# Altium schematic sheet [05] SENSORS.SchDoc
size A
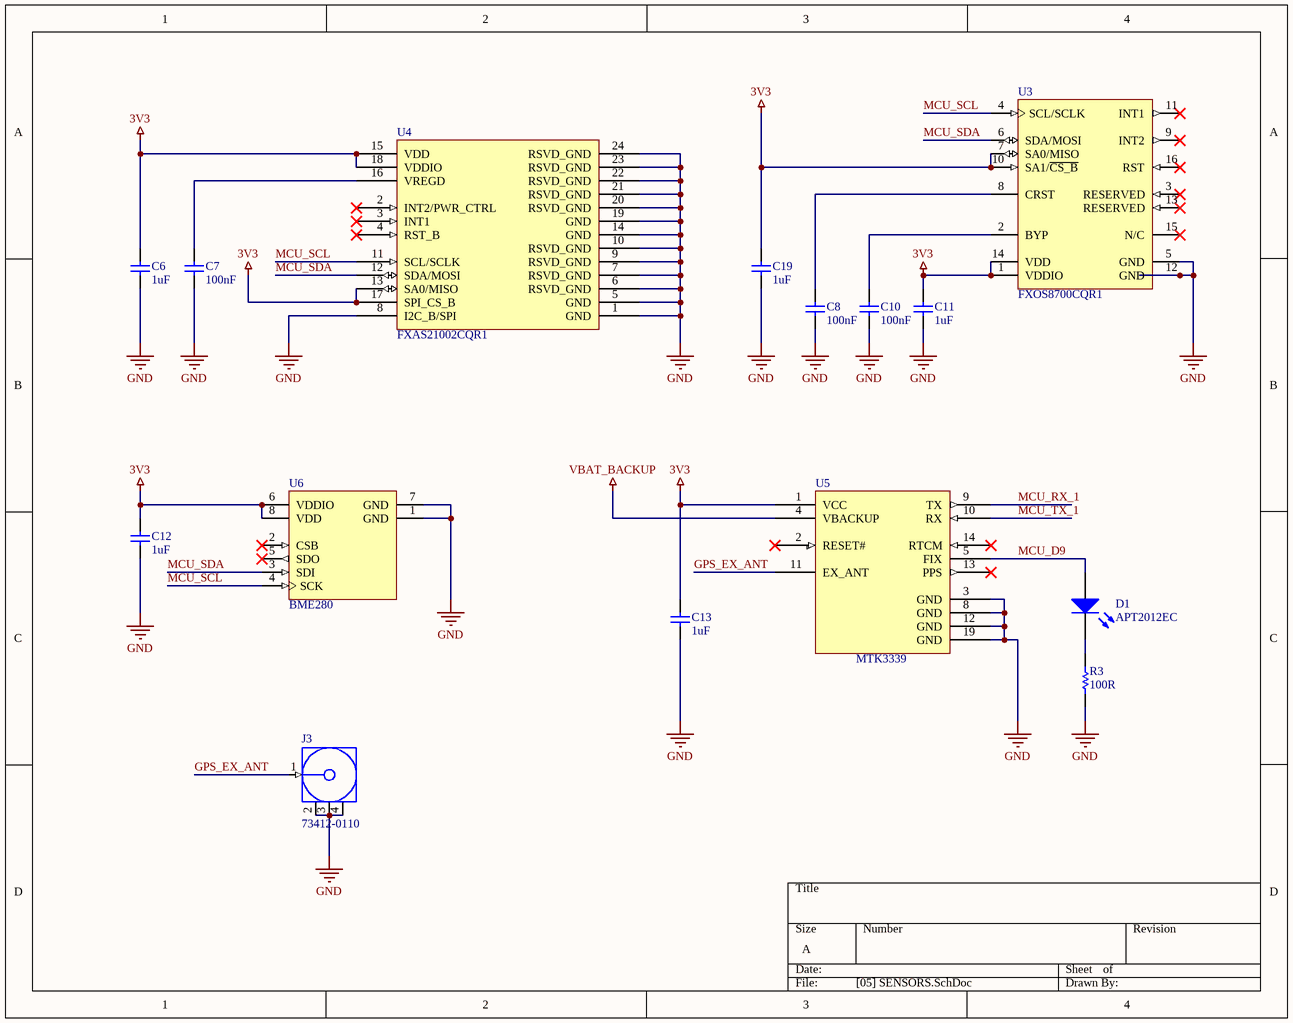
[diagram p0: [05] SENSORS.SchDoc]

## Parts
C6  1uF  [INCH 0805 - METRIC 2012 - H140]
C7  100nF  [INCH 0805 - METRIC 2012 - H120]
C8  100nF  [INCH 0805 - METRIC 2012 - H120]
C10  100nF  [INCH 0805 - METRIC 2012 - H120]
C11  1uF  [INCH 0805 - METRIC 2012 - H140]
C12  1uF  [INCH 0805 - METRIC 2012 - H140]
C13  1uF  [INCH 0805 - METRIC 2012 - H140]
C19  1uF  [INCH 0805 - METRIC 2012 - H140]
D1  APT2012EC  [LED - 0805 - GREEN]
J3  73412-0110  [MOLX-73412-0110_V]
R3  100R  [INCH 0805 - METRIC 2012 - H070]
U3  FXOS8700CQR1  [FREE-QFN-16-3000X3000DE_V]
U4  FXAS21002CQR1  [FXAS21002CQR1]
U5  MTK3339  [MTK3339]
U6  BME280  [BOSC-BME280-8_V]

## Nets
3V3: C6.2 C11.2 C12.2 C13.2 C19.2 U3.1(VDDIO) U3.7(SA0/MISO) U3.10(SA1/~{CS_B}) U3.14(VDD) U4.13(SA0/MISO) U4.15(VDD) U4.17(SPI_CS_B) U4.18(VDDIO) U5.1(VCC) U6.6(VDDIO) U6.8(VDD)
GND: C6.1 C7.1 C8.1 C10.1 C11.1 C12.1 C13.1 C19.1 J3.2(GND) J3.3(GND) J3.4(GND) R3.1 U3.5(GND) U3.12(GND) U4.1(GND) U4.5(GND) U4.6(RSVD_GND) U4.7(RSVD_GND) U4.8(I2C_B/SPI) U4.9(RSVD_GND) U4.10(RSVD_GND) U4.14(GND) U4.19(GND) U4.20(RSVD_GND) U4.21(RSVD_GND) U4.22(RSVD_GND) U4.23(RSVD_GND) U4.24(RSVD_GND) U5.3(GND) U5.8(GND) U5.12(GND) U5.19(GND) U6.1(GND) U6.7(GND)
VBAT_BACKUP: U5.4(VBACKUP)
GPS_EX_ANT: J3.1(SIGNAL) U5.11(EX_ANT)
MCU_D9: D1.A U5.5(FIX)
MCU_RX_1: U5.9(TX)
MCU_SCL: U3.4(SCL/SCLK) U4.11(SCL/SCLK) U6.4(SCK)
MCU_SDA: U3.6(SDA/MOSI) U4.12(SDA/MOSI) U6.3(SDI)
MCU_TX_1: U5.10(RX)
NetC7_2: C7.2 U4.16(VREGD)
NetC8_2: C8.2 U3.8(CRST)
NetC10_2: C10.2 U3.2(BYP)
NetD1_C: D1.C R3.2

Not connected (* = marked no-connect by the designer): U3 3(RESERVED)* 9(INT2)* 11(INT1)* 13(RESERVED)* 15(N/C)* 16(RST)*; U4 2(INT2/PWR_CTRL)* 3(INT1)* 4(RST_B)*; U5 2(RESET#)* 13(PPS)* 14(RTCM)*; U6 2(CSB)* 5(SDO)*

## Library data of the parts
C6 C11-C13 C19 = GCM21BR71E105KA56L: CAP SMD 1uF 25V 10% 0805; Manufacturer: Murata; Dielectric: X7R; Supplier 1: Digi-Key; Manufacturer Part Number: GCM21BR71E105KA56L; RoHS: Yes; Category: Ceramic Capacitors; Stock 1: 1572955; Pricing 1: 1=0.33000, 10=0.22500, 100=0.12760, 500=0.09004, 1000=0.07878 (USD); Mount: Surface Mount; Case/Package: 0805; Case Code (Metric): 2012; Case Code (Imperial): 0805; Min Operating Temperature: -55°C; Max Operating Temperature: 125°C; Termination: SMD/SMT; Voltage: 25V; Package Quantity: 3000; Capacitance: 1uF; Voltage Rating: 25V; Tolerance: 10%; Packaging: Tape and Reel; Voltage Rating (DC): 25V; Length: 2mm; Height: 1.25mm; Thickness: 0.055inch; Depth: 1.25mm; Width: 0.049inch; Ratings: AEC-Q200; Radiation Hardening: No; REACH SVHC: No SVHC; Lead Free: Lead Free; ComponentLink1URL: https://datasheet.ciiva.com/3778/359gcm21br71e105ka5623-3778560.pdf?src-supplier=Arrow; ComponentLink1Description: https://datasheet.ciiva.com/3778/359gcm21br71e105ka5623-3778560.pdf?src-supplier=Arrow; ComponentLink2URL: https://datasheet.ciiva.com/16624/product-16624576.pdf?src-supplier=Avnet+Europe; ComponentLink2Description: https://datasheet.ciiva.com/16624/product-16624576.pdf?src-supplier=Avnet+Europe; ComponentLink3URL: https://datasheet.ciiva.com/18183/getdatasheetpartid-153106-18183696.pdf?src-supplier=Verical; ComponentLink3Description: https://datasheet.ciiva.com/18183/getdatasheetpartid-153106-18183696.pdf?src-supplier=Verical; ComponentLink4URL: https://datasheet.ciiva.com/11789/0900766b80ef92d0-11789092.pdf?src-supplier=RSComponents; ComponentLink4Description: https://datasheet.ciiva.com/11789/0900766b80ef92d0-11789092.pdf?src-supplier=RSComponents; ComponentLink5URL: https://datasheet.ciiva.com/137/product-137199.pdf?src-supplier=Digi-Key; ComponentLink5Description: https://datasheet.ciiva.com/137/product-137199.pdf?src-supplier=Digi-Key; ComponentLink6URL: https://datasheet.ciiva.com/137/product-137200.pdf?src-supplier=Digi-Key; ComponentLink6Description: https://datasheet.ciiva.com/137/product-137200.pdf?src-supplier=Digi-Key; ComponentLink7URL: https://datasheet.ciiva.com/137/product-137201.pdf?src-supplier=Digi-Key; ComponentLink7Description: https://datasheet.ciiva.com/137/product-137201.pdf?src-supplier=Digi-Key; ComponentLink8URL: https://datasheet.ciiva.com/2989/product-2989245.pdf?src-supplier=Avnet; ComponentLink8Description: https://datasheet.ciiva.com/2989/product-2989245.pdf?src-supplier=Avnet; ComponentLink9URL: https://datasheet.ciiva.com/2989/product-2989246.pdf?src-supplier=Avnet; ComponentLink9Description: https://datasheet.ciiva.com/2989/product-2989246.pdf?src-supplier=Avnet; Supplier Part Number 1: 490-4785-1-ND
C7 C8 C10 = C0805C104K1RACTU: CAP CER 0.1UF 100V X7R 0805; Manufacturer: KEMET; Dielectric Material: Ceramic; Tolerance: 10%; Dissipation Factor: 2.5%; Supplier 1: Digi-Key; Manufacturer Part Number: C0805C104K1RACTU; Stock 1: 25000; Pricing 1: 1=0.33, 10=0.226, 100=0.1147, 500=0.07848, 1000=0.06943 (USD); Mount: Surface Mount,PCB; Case/Package: 0805; Number of Pins: 2; Case Code (Imperial): 0805; Case Code (Metric): 2012; Contact Plating: Tin,Matte; Min Operating Temperature: -55°C; Max Operating Temperature: 125°C; Capacitance: 100nF; Voltage Rating: 100V; Packaging: Tape and Reel; Package Quantity: 1; Voltage Rating (DC): 100V; Dielectric: X7R; Termination: SMD/SMT; Voltage: 100V; Length: 2mm; Height: 1mm; Width: 1.2mm; Lead Pitch: 0.75mm; Thickness: 0.043inch; Depth: 1.25mm; Radiation Hardening: No; REACH SVHC: No SVHC; ComponentLink1URL: https://datasheet.ciiva.com/7842/1776102-7842535.pdf; ComponentLink1Description: https://datasheet.ciiva.com/7842/1776102-7842535.pdf; ComponentLink2URL: https://datasheet.ciiva.com/14589/70095383-14589479.pdf; ComponentLink2Description: https://datasheet.ciiva.com/14589/70095383-14589479.pdf; ComponentLink3URL: https://datasheet.ciiva.com/5411/kem-c1002-x7r-smd-5411498.pdf; ComponentLink3Description: https://datasheet.ciiva.com/5411/kem-c1002-x7r-smd-5411498.pdf; Supplier Part Number 1: 399-3486-1-ND; Category: Capacitor
D1 = APT2012EC: LED RED CLEAR CHIP SMD; Manufacturer: Kingbright; Power Rating: 75mW; Luminous Intensity: 12mcd; Viewing Angle: 120°; Lens Style: Clear,Flat; Number of LEDs: 1; Wavelength: 625nm; Test Current: 20mA; Forward Voltage: 2V; Supplier 1: Digi-Key; Manufacturer Part Number: APT2012EC; RoHS: Yes; Category: LEDs; Stock 1: 35644; Pricing 1: 1=0.35000, 10=0.25700, 100=0.12150, 500=0.08100, 1000=0.06345 (USD); Mount: Surface Mount; Case/Package: 0805; Number of Pins: 2; Case Code (Metric): 2012; Color: Red; Case Code (Imperial): 0805; Lens Color: Clear; Min Operating Temperature: -40°C; Max Operating Temperature: 85°C; Packaging: Tape and Reel; Package Quantity: 1; Dominant Wavelength: 625nm; Illumination Color: Red; Forward Current: 20mA; Length: 2mm; Height: 0.75mm; Width: 1.25mm; Lead Free: Lead Free; ComponentLink1URL: https://datasheet.ciiva.com/2113/apt2012ec-2113812.pdf?src-supplier=Digi-Key; ComponentLink1Description: https://datasheet.ciiva.com/2113/apt2012ec-2113812.pdf?src-supplier=Digi-Key; ComponentLink2URL: https://datasheet.ciiva.com/4688/apt2012ec-35230-4688685.pdf?src-supplier=Mouser; ComponentLink2Description: https://datasheet.ciiva.com/4688/apt2012ec-35230-4688685.pdf?src-supplier=Mouser; ComponentLink3URL: https://datasheet.ciiva.com/2113/apt2012ec-2113813.pdf?src-supplier=Digi-Key; ComponentLink3Description: https://datasheet.ciiva.com/2113/apt2012ec-2113813.pdf?src-supplier=Digi-Key; ComponentLink4URL: https://datasheet.ciiva.com/2113/apt2012ec-2113814.pdf?src-supplier=Digi-Key; ComponentLink4Description: https://datasheet.ciiva.com/2113/apt2012ec-2113814.pdf?src-supplier=Digi-Key; Supplier Part Number 1: 754-1128-1-ND
J3 = CMP-1676-00003-1: MCRF, PCB Vertical Jack Receptacle, 50 Ohm, 4-Pin SMD, RoHS, Tape and Reel; Voltage Rating (AC): 60 V; Mating Cycles: 30; Impedance: 50 Ohm; Frequency: 6 Hz; Gender: Female; RoHSCompliant: true; Length: 3 mm; DatasheetVersion: 04/2016; ComponentLink3URL: http://www.molex.com/pdm_docs/sd/734120110_sd.pdf; Max Operating Temperature: 90 degC; Contact Material: Bronze; Mount: Surface Mount; ComponentLink2Description: Datasheet; Packaging: Tape and Reel; Radiation Hardening: No; Voltage Rating: 60 V; Mounting Technology: Surface Mount; ComponentLink1Description: Manufacturer URL; ComponentLink1URL: http://www.molex.com/; Width: 3 mm; ComponentLink3Description: Package Specification; Package Quantity: 5000; PackageReference: 73412-0110; Min Operating Temperature: -40 degC; Height: 1.25 mm; REACH SVHC: Unknown; ComponentLink2URL: http://www.molex.com/webdocs/datasheets/pdf/en-us/0734120110_RF_COAX_CONNECTORS.pdf; Contact Plating: Gold; PackageDescription: 4-Leads SMD, Body 2.6 x 2.6 mm; PackageVersion: Rev. C14, 07/2015
R3 = ERJ-P06J101V: RES SMD 100 OHM 5% 1/2W 0805; Manufacturer: Panasonic; Temperature Coefficient: 200ppm/°C; Power Rating: 500mW; Voltage Rating: 400V; Voltage Rating (DC): 150V; Supplier 1: Digi-Key; Manufacturer Part Number: ERJ-P06J101V; RoHS: Yes; Category: Chip SMD Resistors; Stock 1: 141947; Pricing 1: 1=0.11000, 10=0.10300, 100=0.03960, 1000=0.01742, 2500=0.01505 (USD); Mount: Surface Mount; Case/Package: 0805; Weight: 0.000194oz; Contact Plating: Tin; Case Code (Imperial): 0805; Case Code (Metric): 2012; Min Operating Temperature: -55°C; Max Operating Temperature: 155°C; Resistance: 100R; Tolerance: 5%; Composition: Thick Film; Packaging: Tape and Reel; Package Quantity: 1; Max Power Dissipation: 500mW; Number of Terminations: 2; Military Standard: Not; Termination: SMD/SMT; Features: Automotive AEC-Q200; Length: 2mm; Height: 0.6mm; Width: 1.2mm; Depth: 1.25mm; Lead Free: Lead Free; REACH SVHC: Unknown; ComponentLink1URL: https://datasheet.ciiva.com/11810/0900766b812cb812-11810156.pdf?src-supplier=RSComponents; ComponentLink1Description: https://datasheet.ciiva.com/11810/0900766b812cb812-11810156.pdf?src-supplier=RSComponents; ComponentLink2URL: https://datasheet.ciiva.com/16788/70068906-16788678.pdf?src-supplier=Allied+Electronics; ComponentLink2Description: https://datasheet.ciiva.com/16788/70068906-16788678.pdf?src-supplier=Allied+Electronics; ComponentLink3URL: https://datasheet.ciiva.com/7831/aoa0000ce4-7831000.pdf?src-supplier=Element14; ComponentLink3Description: https://datasheet.ciiva.com/7831/aoa0000ce4-7831000.pdf?src-supplier=Element14; ComponentLink4URL: https://datasheet.ciiva.com/16767/70068906-16767564.pdf?src-supplier=Allied+Electronics; ComponentLink4Description: https://datasheet.ciiva.com/16767/70068906-16767564.pdf?src-supplier=Allied+Electronics; ComponentLink5URL: https://datasheet.ciiva.com/9186/aoa0000ce4-9186844.pdf?src-supplier=Avnet; ComponentLink5Description: https://datasheet.ciiva.com/9186/aoa0000ce4-9186844.pdf?src-supplier=Avnet; ComponentLink6URL: https://datasheet.ciiva.com/24163/aoa0000ce4-64075-24163318.pdf?src-supplier=Mouser; ComponentLink6Description: https://datasheet.ciiva.com/24163/aoa0000ce4-64075-24163318.pdf?src-supplier=Mouser; ComponentLink7URL: https://datasheet.ciiva.com/17208/aoa0000ce4-17208010.pdf?src-supplier=Avnet+Europe; ComponentLink7Description: https://datasheet.ciiva.com/17208/aoa0000ce4-17208010.pdf?src-supplier=Avnet+Europe; Supplier Part Number 1: P100ADCT-ND
U3 = CMP-2000-05129-1: 6-Axis Xtrinsic Sensor with Integrated Linear Accelerometer and Magnetometer, 1.95 to 3.6 V, -40 to 85 degC, 16-Pin QFN, RoHS, Tape and Reel; Manufacturer: Freescale; Supply Voltage - Min: 1.95V; Operating Supply Voltage: 1.95Vto3.6V; Unit Weight: 0.000808oz; Supply Voltage - Max: 3.6V; Brand: FreescaleSemiconductor; Sensing Axis: X,Y,Z; Output Type: Digital; Package / Case: QFN-16; Datasheet Version: Rev. 1, 06/2012; Factory Pack Quantity: 1000; Mounting Style: SMD/SMT; Datasheet URL: https://datasheet.ciiva.com/12175/fxos8700cq-60595-12175213.pdf; Type: 6AxisSensor; Maximum Operating Temperature: +85C; Manufacturer URL: http://www.nxp.com/; Package Description: 16-Pin Quad Flat No-lead Package, Body 3 x 3 mm, Pitch 0.5 mm; RoHS: Details; Package Reference: QFN-16; Tradename: Xtrinsic; Packaging: Reel; Minimum Operating Temperature: -40C; Product Category: BoardMountAccelerationSensors
U4 = FXAS21002CQR1: NXP Precision 3 Axis Gyro I2C; Supplier 1: Digi-Key; Supplier Part Number 1: FXAS21002CQR1CT-ND
U5 = MTK3339: Ultimate GPS Module 66 channel 10 Hz
U6 = CMP-2000-05073-1: Combined Humidity and Pressure Sensor, 1.71 to 3.6 V, -40 to 85 degC, 8-Pin SMD, RoHS, Tape and Reel; Manufacturer: Bosch Sensortec; Datasheet Version: Rev. 1.2, 10/2015; Datasheet URL: http://datasheet.octopart.com/BME280-Bosch-datasheet-58577763.pdf; Manufacturer URL: http://www.bosch-sensortec.com